# Altium schematic sheet can.SchDoc
size A4; SheetNumber: 7; SheetTotal: 8
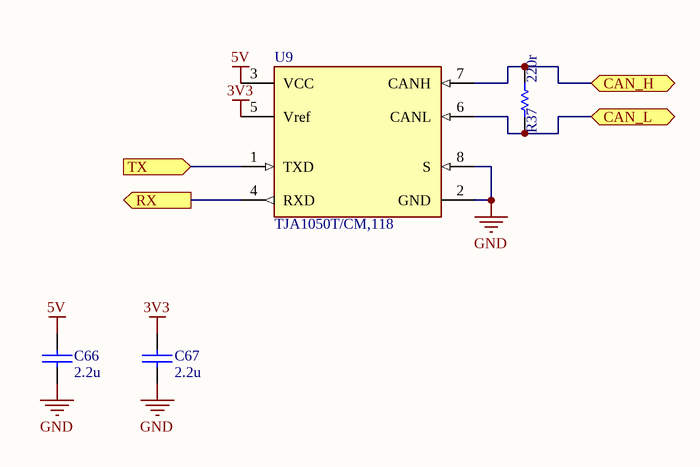
[diagram p0: can.SchDoc]

## Parts
C66  2.2u  [0603C]
C67  2.2u  [0603C]
R37  220r  [0603R]
U9  TJA1050T/CM,118  [FP-SOT96-1-IPC_A]

## Ports
CAN_H (bidir), CAN_L (bidir), RX (out), TX (in)

## Nets
3V3: C67.2 U9.5(Vref)
5V: C66.2 U9.3(VCC)
GND: C66.1 C67.1 U9.2(GND) U9.8(S)
CAN_H: R37.2 U9.7(CANH) ; port CAN_H
CAN_L: R37.1 U9.6(CANL) ; port CAN_L
RX: U9.4(RXD) ; port RX
TX: U9.1(TXD) ; port TX

## Library data of the parts
C66 C67 = CAP: 无极性电容
R37 = RES
U9 = CMP-2000-04923-2: IC TRANSCEIVER HALF 1/1 8SO; Simplex/Duplex: Half Duplex; Max Supply Current: 10mA; Number of Receive Buffers: 1; Min Supply Voltage: 4.75V; Max Supply Voltage: 5.25V; Interface: CAN; Data Rate: 1Mbps; Receiver Hysteresis: 70mV; Number of Transmit Buffers: 1; Min Operating Temperature: -40°C; Case/Package: SO; REACH SVHC: No SVHC; Max Operating Temperature: 150°C; Number of Pins: 8; Lead Free: Lead Free; Number of Transceivers: 1; Packaging: Tape and Reel; Mount: Surface Mount; Radiation Hardening: No; Nominal Supply Current: 10mA; Package Quantity: 2500; Contact Plating: Gold